# EAGLE design Mega_Shield-v3 (EAGLE 6.5.0)
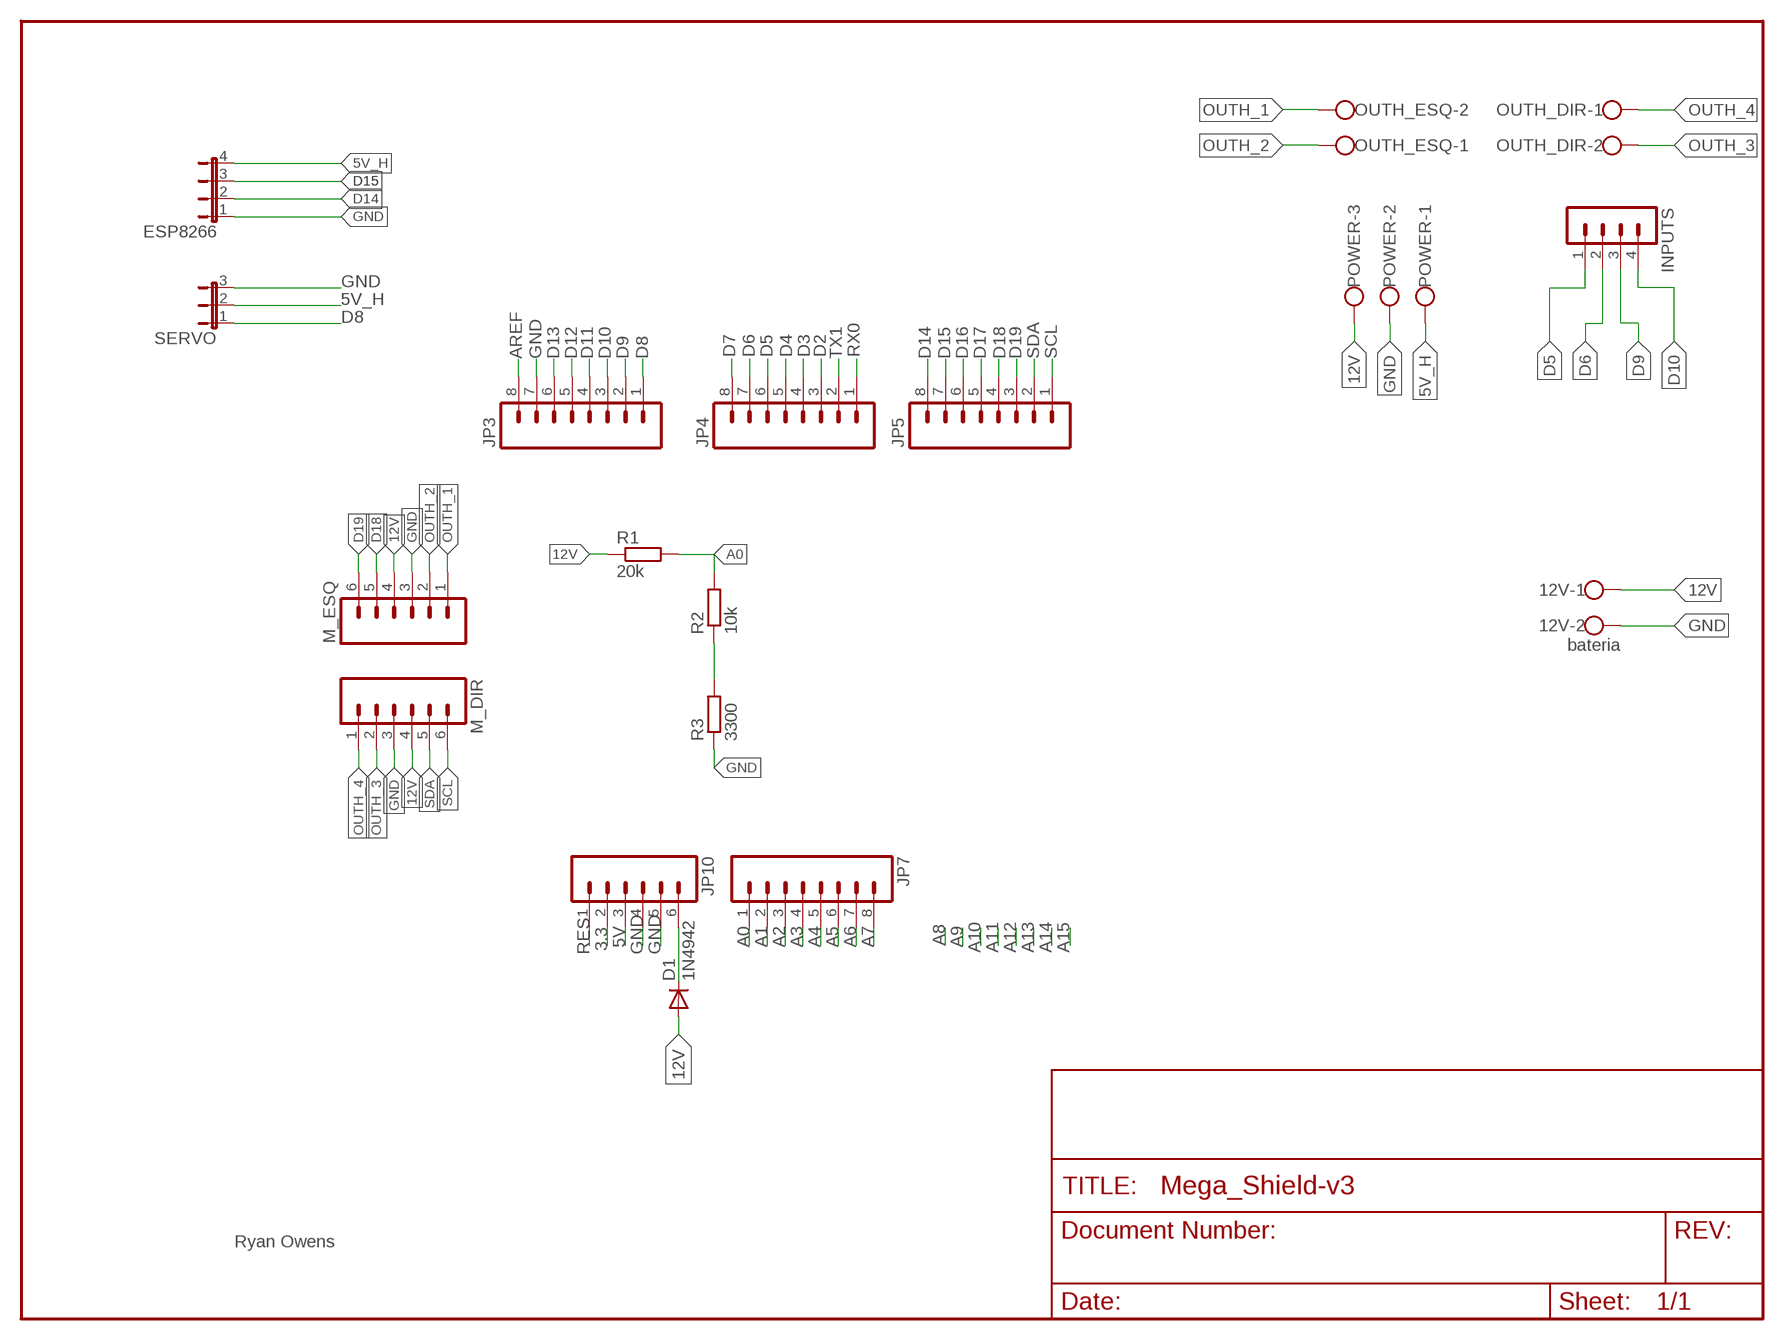
[diagram p0: schematic, sheet 1]

## Parts
12V  bateria  W237-102  [W237-102]
D1  1N4942  [DO41-10]
ESP8266  JP4E  [JP4]
INPUTS  MA04-1  [MA04-1]
JP3  M08LOCK  [1X08_LOCK]
JP4  M08LOCK  [1X08_LOCK]
JP5  M08LOCK  [1X08_LOCK]
JP7  M08LOCK  [1X08_LOCK]
JP10  M06LOCK  [1X06_LOCK]
M_DIR  M06LOCK  [1X06_LOCK]
M_ESQ  M06LOCK  [1X06_LOCK]
OUTH_DIR  W237-102  [W237-102]
OUTH_ESQ  W237-102  [W237-102]
POWER  W237-103  [W237-103]
R1  20k  R-EU_0207/10  [0207/10]
R2  10k  R-EU_0207/10  [0207/10]
R3  3300  R-EU_0207/10  [0207/10]
SERVO  JP2W  [JP2W]

## Nets
3.3: JP10.2
5V: JP10.3
5V_H: ESP8266.4 POWER.1 SERVO.2
12V: 12V.1 D1.A M_DIR.4 M_ESQ.4 POWER.3 R1.1
A0: JP7.1 R1.2 R2.2
A1: JP7.2
A2: JP7.3
A3: JP7.4
A4: JP7.5
A5: JP7.6
A6: JP7.7
A7: JP7.8
AREF: JP3.8
D2: JP4.3
D3: JP4.4
D4: JP4.5
D5: INPUTS.1 JP4.6
D6: INPUTS.2 JP4.7
D7: JP4.8
D8: JP3.1 SERVO.1
D9: INPUTS.3 JP3.2
D10: INPUTS.4 JP3.3
D11: JP3.4
D12: JP3.5
D13: JP3.6
D14: ESP8266.2 JP5.8
D15: ESP8266.3 JP5.7
D16: JP5.6
D17: JP5.5
D18: JP5.4 M_ESQ.5
D19: JP5.3 M_ESQ.6
GND: 12V.2 ESP8266.1 JP3.7 JP10.4 JP10.5 M_DIR.3 M_ESQ.3 POWER.2 R3.1 SERVO.3
N$2: R2.1 R3.2
N$8: D1.C JP10.6
OUTH_1: M_ESQ.1 OUTH_ESQ.2
OUTH_2: M_ESQ.2 OUTH_ESQ.1
OUTH_3: M_DIR.2 OUTH_DIR.2
OUTH_4: M_DIR.1 OUTH_DIR.1
RES: JP10.1
RX0: JP4.1
SCL: JP5.1 M_DIR.6
SDA: JP5.2 M_DIR.5
TX1: JP4.2

## Notes on the sheet
- Ryan Owens

## Library data of the parts
12V OUTH_DIR OUTH_ESQ = con-wago-500:W237-102: WAGO SCREW CLAMP; MPN: 237-102; OC_FARNELL: unknown; OC_NEWARK: 70K9898
D1 = diode:1N4942: DIODE 1.0 A, 200 V, 150 ns
ESP8266 = jumper:JP4E: JUMPER
INPUTS = con-lstb:MA04-1: PIN HEADER; OC_FARNELL: unknown; OC_NEWARK: unknown
JP3-JP5 JP7 = SparkFun:M08: Header 8 Standard 8-pin 0.1" header. Use with straight break away headers (SKU : PRT-00116), right angle break away headers (PRT-00553), swiss pins (PRT-00743), machine pins (PRT-00117), and female headers (PRT-00115).
JP10 M_DIR M_ESQ = SparkFun:M06: Header 6 Standard 6-pin 0.1" header. Use with straight break away headers (SKU : PRT-00116), right angle break away headers (PRT-00553), swiss pins (PRT-00743), machine pins (PRT-00117), and female headers (PRT-00115). Molex polarized connector foot print use with SKU : PRT-08094 with associated crimp pins and housings. NOTES ON THE VARIANTS LOCK and LOCK_LONGPADS... This footprint was designed to help hold the alignment of a through-hole component (i.e. 6-pin header) while soldering it into place. You may notice that each hole has been shifted either up or down by 0.005 of an inch from it's more standard position (which is a perfectly straight line). This slight alteration caused the pins (the squares in the middle) to touch the edges of the holes. Because they are alternating, it causes a "brace" to hold the component in place. 0.005 has proven to be the perfect amount of "off-center" position when using our standard breakaway headers. Although looks a little odd when you look at the bare footprint, once you have a header in there, the alteration is very hard to notice. Also, if you push a header all the way into place, it is covered up entirely on the bottom side. This idea of altering the position of holes to aid alignment will be further integrated into the Sparkfun Library for other footprints. It can help hold any component with 3 or more connection pins.
POWER = con-wago-500:W237-103: WAGO SCREW CLAMP; MPN: 237-103; OC_FARNELL: unknown; OC_NEWARK: 18M7116
R1-R3 = resistor:R-EU_: RESISTOR, European symbol
SERVO = jumper:JP2W: JUMPER

## Board
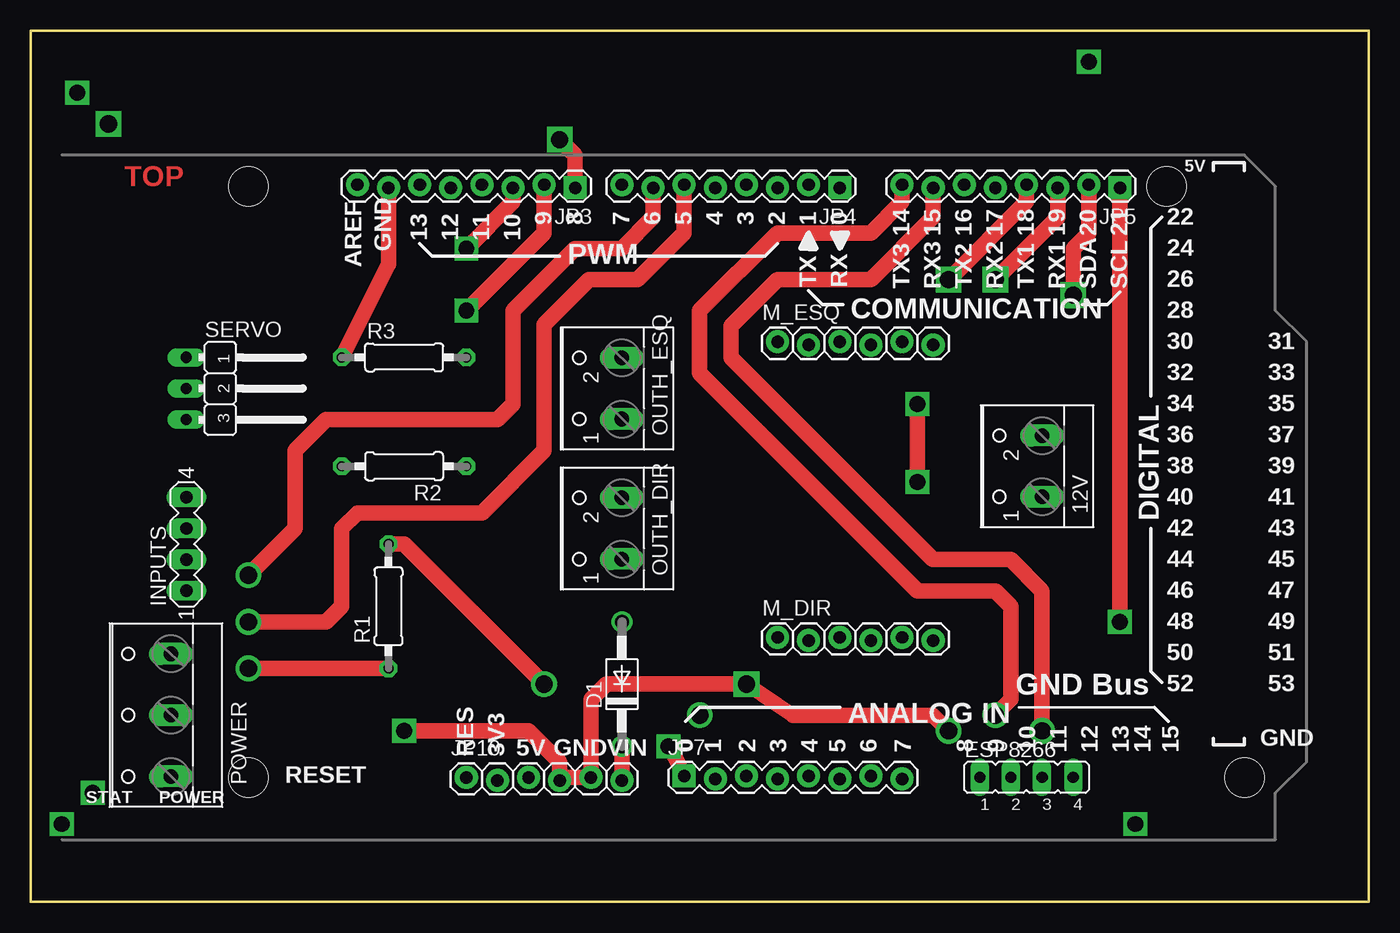
[diagram p1: board, top side]
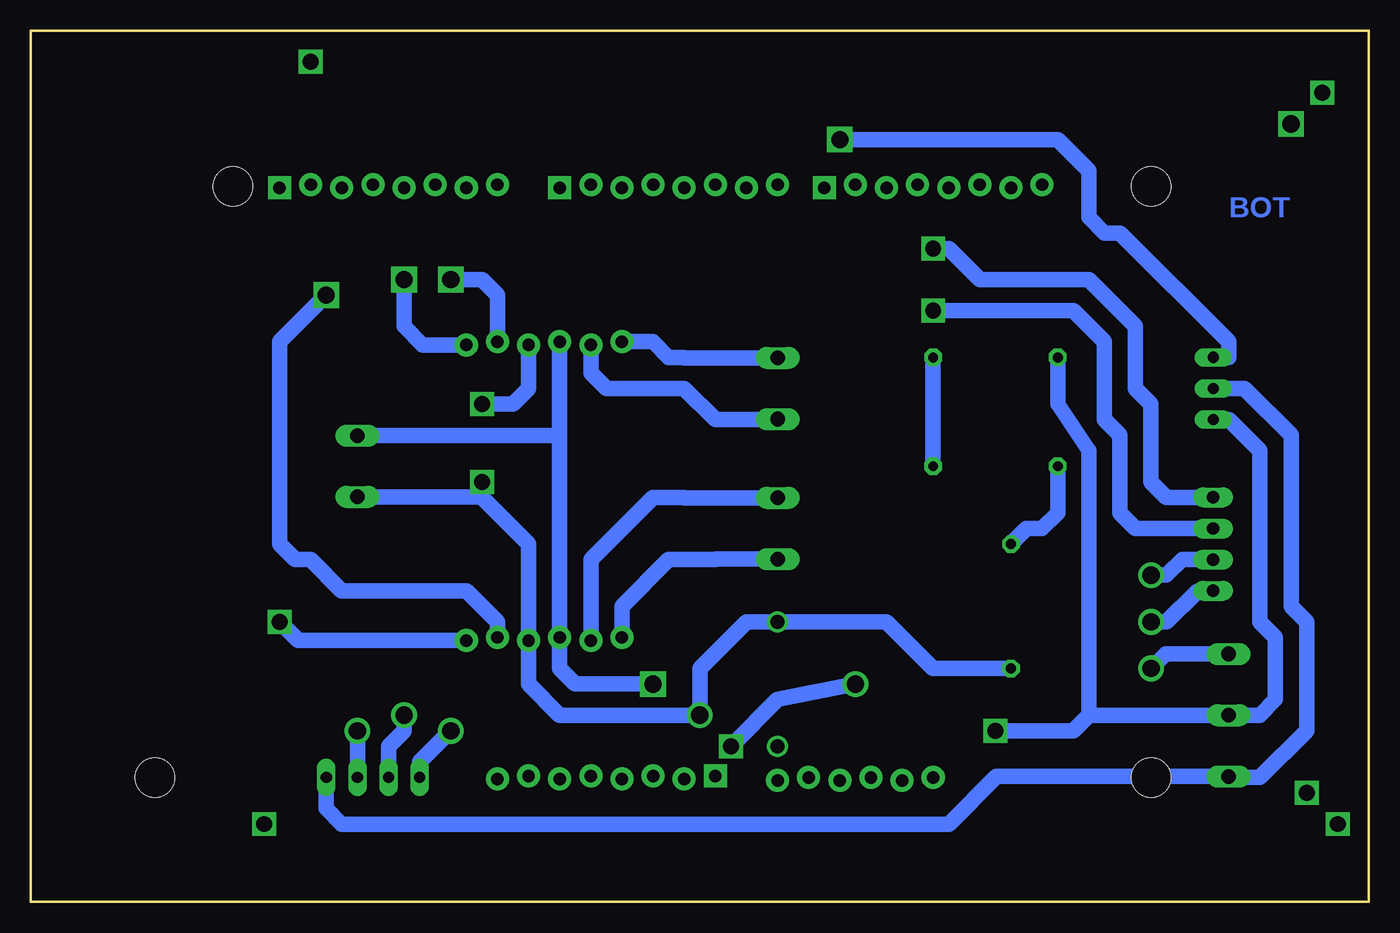
[diagram p2: board, bottom side, seen from below]

Size 109.22 x 71.12 mm. Coordinates in mm from the lower left corner, seen from the top.
Outline: 0,0 109.22,0 109.22,71.12 0,71.12 0,0
Copper layers (1*16): Top 0.035mm / dielectric 1.5mm / Bottom 0.035mm
Design rules "SparkFun *": minimum track width 42mil, minimum drill 34mil, track to track 34mil, track to pad 34mil, pad to pad 34mil, via to via 34mil, smd to smd 8mil, copper to edge 10mil, drill to drill 8mil, minimum pad ring 12mil, minimum via ring 10mil, stop-mask expansion 4mil, vias tented up to drill 25mil, thermal gap 10mil
Holes 3.2 mm at 17.78,58.42 17.78,10.16 92.71,58.42 99.06,10.16

### Footprints (pad centres in the part's own frame; a part is rotated, then mirrored left to right if it is on the bottom)
W237-102 = drill 1.194 long: 1 -2.5,-1.27; 2 2.5,-1.27
DO41-10 = drill 1.118: A 5.08,0; C -5.08,0
JP4 = drill 0.914 long: 1 -3.81,0; 2 -1.27,0; 3 1.27,0; 4 3.81,0
MA04-1 = drill 1.016 long: 1 -3.81,0; 2 -1.27,0; 3 1.27,0; 4 3.81,0
1X08_LOCK = drill 1.016 pad 1.88 square: 1 0,0.127 | drill 1.016 pad 1.88: 2 2.54,-0.127; 3 5.08,0.127; 4 7.62,-0.127; 5 10.16,0.127; 6 12.7,-0.127; 7 15.24,0.127; 8 17.78,-0.127
1X06_LOCK = drill 1.016 pad 1.88: 1 0,0; 2 2.54,-0.254; 3 5.08,0; 4 7.62,-0.254; 5 10.16,0; 6 12.7,-0.254
W237-103 = drill 1.194 long: 1 -5,-1.29; 2 0,-1.29; 3 5,-1.29
0207/10 = drill 0.813 octagon: 1 -5.08,0; 2 5.08,0
JP2W = drill 0.914 long: 1 -2.54,-1.27; 2 0,-1.27; 3 2.54,-1.27

### Placement (x,y rotation side)
12V  81.28,35.56 90 top
D1  48.26,17.78 90 top
ESP8266  81.28,10.16 0 top
INPUTS  12.7,29.21 90 top
JP3  44.45,58.42 180 top
JP4  66.04,58.42 180 top
JP5  88.9,58.42 180 top
JP7  53.34,10.16 0 top
JP10  35.56,10.16 0 top
M_DIR  60.96,21.59 0 top
M_ESQ  60.96,45.72 0 top
OUTH_DIR  46.99,30.48 90 top
OUTH_ESQ  46.99,41.91 90 top
POWER  10.16,15.24 90 top
R1  29.21,24.13 90 top
R2  30.48,35.56 180 top
R3  30.48,44.45 0 top
SERVO  13.97,41.91 270 top

### Tracks (layer width: path | path; a pad name or v marks a point on that pad's centre or on a via)
5V_H
  Bottom 1.27: ESP8266.4 85.09,7.62 83.82,6.35 34.29,6.35 30.4,10.24 POWER.1 11.37,10.16 8.89,10.16 5.08,13.97 5.08,22.86 6.35,24.13 6.35,38.1 10.16,41.91 SERVO.2
12V  (via drill 0.9, 1.3, 1.4)
  Top 1.27: v72.39,40.64 v72.39,34.29 | v17.78,19.05 R1.1
  Bottom 0.813: 72.43,33.06 72.39,33.02 v72.39,34.29
  Bottom 1.27: 12V.1 72.43,33.06 | 72.39,33.02 68.58,29.21 M_DIR.4 68.58,17.78 66.04,15.24 v54.61,15.24 54.61,19.05 50.8,22.86 D1.A 39.37,22.86 35.56,19.05 R1.1 | v72.39,40.64 69.85,40.64 68.58,41.91 M_ESQ.4 | v17.78,19.05 16.59,20.24 POWER.3
A0  (via drill 0.9, 1.3, 1.4)
  Top 0.813: v52.07,12.7 52.2,12.7
  Top 1.27: 52.2,12.7 JP7.1 | v41.91,17.78 30.48,29.21 R1.2
  Bottom 1.27: R2.2 25.4,31.75 26.67,30.48 27.94,30.48 R1.2 | v41.91,17.78 48.26,16.51 v52.07,12.7
D5  (via drill 1.2, 1.4)
  Top 1.27: JP4.6 53.34,54.61 49.53,50.8 45.59,50.8 41.91,47.12 41.91,36.83 36.83,31.75 26.67,31.75 25.4,30.48 25.4,24.13 24.13,22.86 v17.78,22.86
  Bottom 1.27: INPUTS.1 13.97,25.4 16.51,22.86 v17.78,22.86
D6  (via drill 0.6, 1.2, 1.3, 1.4)
  Top 0.813: 39.37,45.72 39.37,46.99
  Top 1.27: JP4.7 50.8,55.88 48.26,53.34 44.45,53.34 39.37,48.26 39.37,45.72 39.37,40.64 38.1,39.37 24.13,39.37 21.59,36.83 21.59,30.48 v17.78,26.67
  Bottom 1.27: INPUTS.2 15.24,27.94 16.51,26.67 v17.78,26.67
D8  (via drill 1.4)
  Top 1.27: v43.18,62.23 44.45,60.96 JP3.1
  Bottom 1.27: SERVO.1 11.43,44.45 11.43,45.72 20.32,54.61 21.59,54.61 22.86,55.88 22.86,59.69 25.4,62.23 v43.18,62.23
D9  (via drill 0.9, 1.3)
  Top 1.27: JP3.2 41.91,54.61 v35.56,48.26
  Bottom 1.27: v35.56,48.26 24.13,48.26 21.59,45.72 21.59,39.37 20.32,38.1 20.32,31.75 19.05,30.48 INPUTS.3
D10  (via drill 0.9, 1.3)
  Top 1.27: JP3.3 39.37,57.15 v35.56,53.34
  Bottom 1.27: v35.56,53.34 34.29,53.34 31.75,50.8 22.86,50.8 19.05,46.99 19.05,41.91 17.78,40.64 17.78,34.29 16.51,33.02 INPUTS.4
D14  (via drill 1.4)
  Top 1.27: JP5.8 71.12,57.15 68.58,54.61 60.96,54.61 54.61,48.26 54.61,43.18 72.39,25.4 78.74,25.4 80.01,24.13 80.01,16.51 v78.74,15.24
  Bottom 1.27: v78.74,15.24 78.74,13.97 80.01,12.7 ESP8266.2
D15  (via drill 1.4)
  Top 1.27: JP5.7 73.66,55.88 68.58,50.8 60.96,50.8 57.15,46.99 57.15,44.45 73.66,27.94 80.01,27.94 82.55,25.4 v82.55,13.97
  Bottom 1.27: v82.55,13.97 ESP8266.3
D18  (via drill 1.4)
  Top 1.27: JP5.4 81.28,57.15 v74.93,50.8
  Bottom 1.27: v74.93,50.8 72.39,50.8 71.12,49.53 M_ESQ.5
D19  (via drill 0.9, 1.4)
  Top 1.27: JP5.3 83.82,55.88 v78.74,50.8
  Bottom 1.27: M_ESQ.6 77.22,45.47 78.74,46.99 v78.74,50.8
GND  (via drill 0.9, 1.3, 1.4)
  Top 0.813: 43.43,10.16 JP10.4
  Top 1.27: JP3.7 29.21,52.07 R3.1 | v30.48,13.97 40.64,13.97 43.18,11.43 JP10.4 | 43.43,10.16 JP10.5 45.72,16.51 46.99,17.78 v58.42,17.78 62.23,15.24 73.66,15.24 v74.93,13.97
  Bottom 0.813: 66.08,38.06 66.04,38.1
  Bottom 1.27: R3.1 25.4,40.64 22.86,36.83 22.86,15.24 | v58.42,17.78 64.77,17.78 66.04,19.05 M_DIR.3 66.04,38.1 M_ESQ.3 | 12V.2 66.08,38.06 | 22.86,15.24 POWER.2 8.89,15.24 7.62,16.51 7.62,21.59 8.89,22.86 8.89,36.83 11.43,39.37 SERVO.3 | v30.48,13.97 24.13,13.97 22.86,15.24 | ESP8266.1 77.47,11.43 v74.93,13.97
N$2
  Bottom 1.27: R3.2 R2.1
N$3  (via drill 1.3)
  other vias: 3.81,66.04
N$4  (via drill 1.3)
  other vias: 86.36,68.58
N$5  (via drill 1.3)
  other vias: 90.17,6.35
N$6  (via drill 1.3)
  other vias: 2.54,6.35
N$7  (via drill 1.3)
  other vias: 5.08,8.89
N$8
  Top 1.27: D1.C JP10.6
N$9  (via drill 1.4)
  other vias: 6.35,63.5
OUTH_1
  Bottom 0.813: 55.84,44.41 55.88,44.45
  Bottom 1.27: OUTH_ESQ.2 55.84,44.41 | 55.88,44.45 57.15,44.45 58.42,45.72 M_ESQ.1
OUTH_2
  Bottom 0.813: 48.3,39.37 OUTH_ESQ.1
  Bottom 1.27: M_ESQ.2 63.5,43.18 62.23,41.91 55.88,41.91 53.34,39.37 48.3,39.37
OUTH_3
  Bottom 1.27: OUTH_DIR.2 55.84,32.98 55.88,33.02 58.42,33.02 63.5,27.94 M_DIR.2
OUTH_4
  Bottom 1.27: OUTH_DIR.1 53.3,27.98 53.34,27.94 57.15,27.94 60.96,24.13 M_DIR.1
SCL  (via drill 0.9, 1.3)
  Top 1.27: v88.9,22.86 JP5.1
  Bottom 1.27: M_DIR.6 87.38,21.34 v88.9,22.86
SDA  (via drill 0.9, 1.4)
  Top 1.27: v85.09,49.53 85.09,53.34 86.36,54.61 JP5.2
  Bottom 1.27: M_DIR.5 71.12,22.86 73.66,25.4 83.82,25.4 86.36,27.94 87.63,27.94 88.9,29.21 88.9,45.72 v85.09,49.53

### Text on the board
Top: TOP
Bottom: BOT
tPlace: 5V | 9 | 8 | 7 | 6 | 5 | 4 | 3 | 2 | 1 | 0 | 22 | 14 | 15 | 16 | 17 | 18 | 19 | 20 | 21 | 13 | 12 | 11 | 10 | GND | 24 | AREF | PWM | TX | RX | 26 | TX3 | RX3 | TX2 | RX2 | TX1 | RX1 | SDA | SCL | COMMUNICATION | 28 | 30 | 31 | 32 | 33 | 34 | 35 | 36 | 37 | 38 | 39 | 40 | 41 | DIGITAL | 42 | 43 | 44 | 45 | 46 | 47 | 48 | 49 | 50 | 51 | 52 | 53 | GND Bus | ANALOG IN | 0 | 1 | 2 | 3 | 4 | 5 | 6 | 7 | 8 | 9 | 10 | 11 | 12 | 13 | 14 | 15 | GND | RES | 3V3 | 5V | GND | VIN | RESET | STAT | POWER